# Altium schematic sheet MotorDriver.SchDoc
size A; SheetNumber: 4; SheetTotal: 5
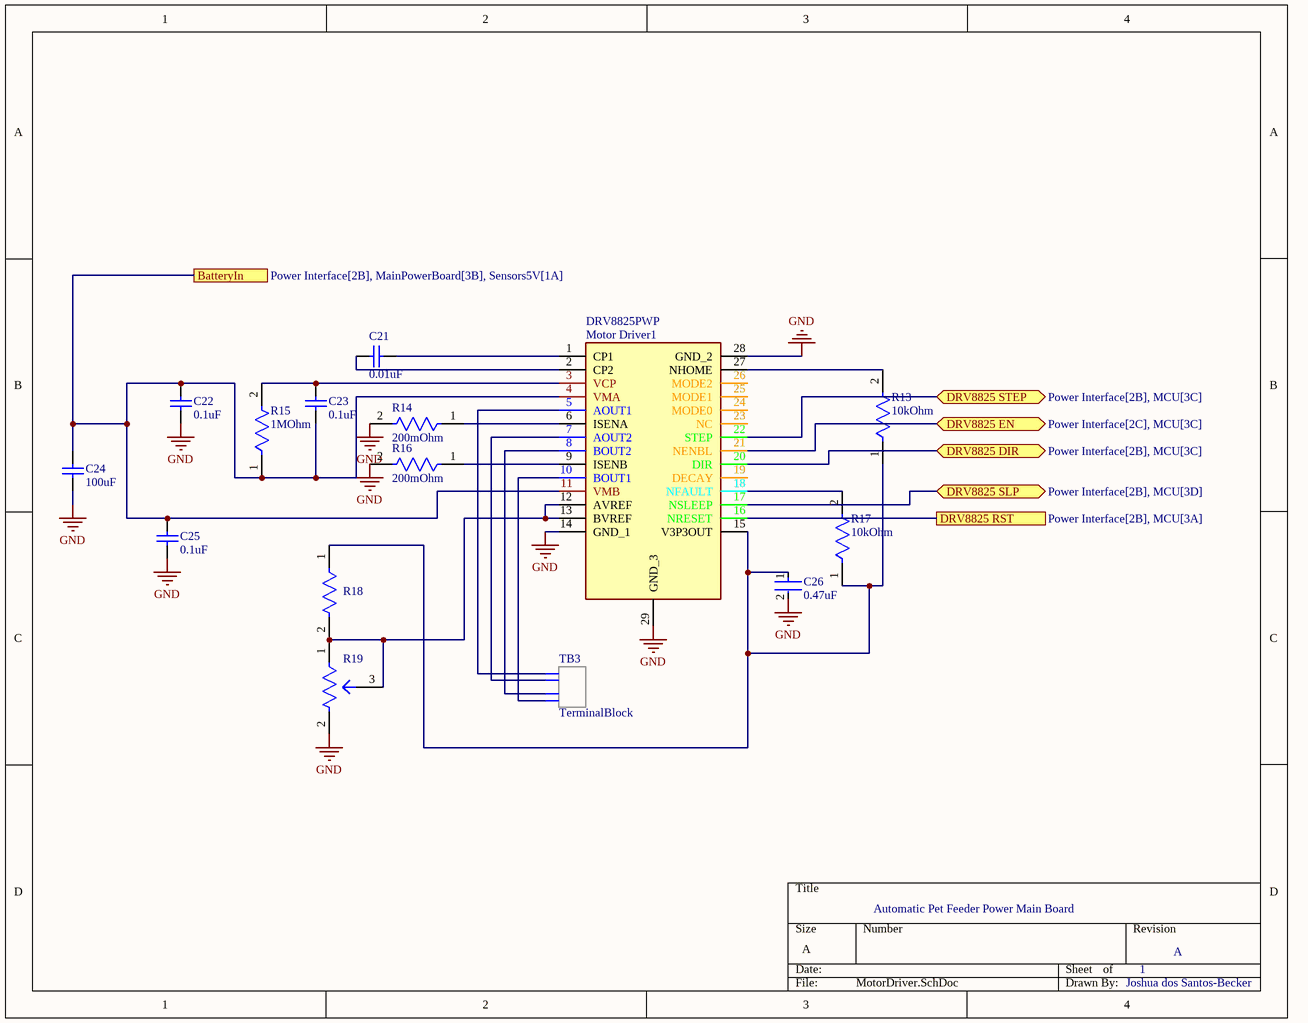
[diagram p0: MotorDriver.SchDoc]

## Parts
C21  0.01uF  [FP-C0603-030-0_03-IPC_A]
C22  0.1uF  [CAPC0603X33N]
C23  0.1uF  [CAPC0603X33N]
C24  100uF  [CAPC3225X279N]
C25  0.1uF  [CAPC0603X33N]
C26  0.47uF  [FP-1206-L_3_2_0_2-W_1_6_0-MFG]
Motor_Driver1  DRV8825PWP  [SOP65P640X120-29N]
R13  10kOhm  [FP-ESR10-IPC_C]
R14  200mOhm  [WSL2512R2000FEA]
R15  1MOhm  [RESC1005X40N]
R16  200mOhm  [WSL2512R2000FEA]
R17  10kOhm  [FP-ESR10-IPC_C]
R18  (no value)  [RESC1005X40N]
R19  (no value)  [SMD Pot]
TB3  TerminalBlock  [PHOENIX_1725672]

## Ports
BatteryIn (see Power Interface[2B], MainPowerBoard[3B], Sensors5V[1A]), DRV8825 DIR (bidir, see Power Interface[2B], MCU[3C]), DRV8825 EN (bidir, see Power Interface[2C], MCU[3C]), DRV8825 RST (see Power Interface[2B], MCU[3A]), DRV8825 SLP (bidir, see Power Interface[2B], MCU[3D]), DRV8825 STEP (bidir, see Power Interface[2B], MCU[3C])

## Nets
GND: C22.1 C24.1 C25.1 C26.2 Motor_Driver1.14(GND_1) Motor_Driver1.28(GND_2) Motor_Driver1.29(GND_3) R14.2 R16.2 R19.2
BatteryIn: C22.2 C23.1 C24.2 C25.2 Motor_Driver1.4(VMA) Motor_Driver1.11(VMB) R15.1 ; port BatteryIn
DRV8825 DIR: Motor_Driver1.20(DIR) ; port DRV8825 DIR
DRV8825 EN: Motor_Driver1.21(NENBL) ; port DRV8825 EN
DRV8825 RST: Motor_Driver1.16(NRESET) ; port DRV8825 RST
DRV8825 SLP: Motor_Driver1.17(NSLEEP) ; port DRV8825 SLP
DRV8825 STEP: Motor_Driver1.22(STEP) ; port DRV8825 STEP
NetC21_1: C21.1 Motor_Driver1.1(CP1)
NetC21_2: C21.2 Motor_Driver1.2(CP2)
NetC23_2: C23.2 Motor_Driver1.3(VCP) R15.2
NetC26_1: C26.1 Motor_Driver1.15(V3P3OUT) R13.1 R17.1 R18.1
NetMotor_Driver1_5: Motor_Driver1.5(AOUT1) TB3.1
NetMotor_Driver1_6: Motor_Driver1.6(ISENA) R14.1
NetMotor_Driver1_7: Motor_Driver1.7(AOUT2) TB3.2
NetMotor_Driver1_8: Motor_Driver1.8(BOUT2) TB3.3
NetMotor_Driver1_9: Motor_Driver1.9(ISENB) R16.1
NetMotor_Driver1_10: Motor_Driver1.10(BOUT1) TB3.4
NetMotor_Driver1_12: Motor_Driver1.12(AVREF) Motor_Driver1.13(BVREF) R18.2 R19.1 R19.3
NetMotor_Driver1_18: Motor_Driver1.18(NFAULT) R17.2
NetMotor_Driver1_27: Motor_Driver1.27(NHOME) R13.2

Not connected (* = marked no-connect by the designer): Motor_Driver1 19(DECAY) 23(NC) 24(MODE0) 25(MODE1) 26(MODE2)

## Notes on the sheet
- Automatic Pet Feeder Power Main Board
- 1
- A
- Joshua dos Santos-Becker

## Library data of the parts
C21 = 0.01uF: C0603X5R1C103M030BA; Voltage Rating (DC): 16V; Capacitance: 10nF; Dielectric Material: Ceramic; Dielectric: X5R; Tolerance: 20%; Length: 0.024inch; Max Operating Temperature: 85°C; Min Operating Temperature: -55°C; Case/Package: 0201; Packaging: Tape and Reel; Lead Free: Lead Free; Mount: Surface Mount; Package Quantity: 15000; Case Code (Imperial): 0201; Width: 0.012inch; RoHS Compliant: Yes; Weight: 6E-06oz; Voltage Rating: 16V; Height: 0.3mm; Thickness: 0.013inch; Case Code (Metric): 0603; Termination: SMD/SMT
C22 C23 C25 = 0.1uF: GRM033C71C104KE14J; Manufacturer_Name: Murata Electronics; Geometry.Height: 0.33mm; Mouser Part Number: 81-GRM033C71C104KE4J; Mouser Price/Stock: https://www.mouser.co.uk/ProductDetail/Murata-Electronics/GRM033C71C104KE14J?qs=QzBtWTOodeU72T%252BpeIULSA%3D%3D; Manufacturer_Part_Number: GRM033C71C104KE14J; Datasheet Link: http://www.murata.com/~/media/webrenewal/support/library/catalog/products/capacitor/mlcc/c02e.pdf
C24 = 100uF: 1210YD107MAT2A
C26 = CMP-04427-014563-1: 12065C474K4Z2A; Capacitance: 470nF; Voltage Rating (DC): 50V; Tolerance: 10%; Dielectric: X7R; RoHS Compliant: Yes; Radiation Hardening: No; Case Code (Metric): 3216; Mount: Surface Mount; Min Operating Temperature: -55°C; Features: Soft Termination; Case Code (Imperial): 1206; Thickness: 0.06inch; Max Operating Temperature: 125°C; Case/Package: 1206; Length: 0.126inch; Depth: 1.6mm; Packaging: Tape and Reel; Series: FLEXITERM®; Ratings: AEC-Q200; Width: 0.063inch; Voltage Rating: 50V
Motor_Driver1 = DRV8825PWP: 2.5A Stepper Motor Driver HTSSOP28 Texas Instruments DRV8825PWP, Stepper Motor Driver, 28-Pin HTSSOP; Geometry.Height: 1.2mm; Mouser Part Number: 595-DRV8825PWP; Mouser Price/Stock: https://www.mouser.co.uk/ProductDetail/Texas-Instruments/DRV8825PWP?qs=L4ss%2FyqpMWT%252BKNufX9tf3Q%3D%3D; Manufacturer_Name: Texas Instruments; Manufacturer_Part_Number: DRV8825PWP; Datasheet Link: http://www.ti.com/lit/ds/symlink/drv8825.pdf
R13 R17 = CMP-08839-028179-1: ESR10EZPD1002; RoHS Compliant: Yes
R14 R16 = 200mOhm: WSL2512R2000FEA
R15 = 1MOhm: CRCW04021M00FKEDHP
R18 = 50kOhm: CRCW040250K0FKED
R19 = 30kPot: TC33X-2-303E Bourns